# Altium schematic sheet mainsheet.SchDoc
size B
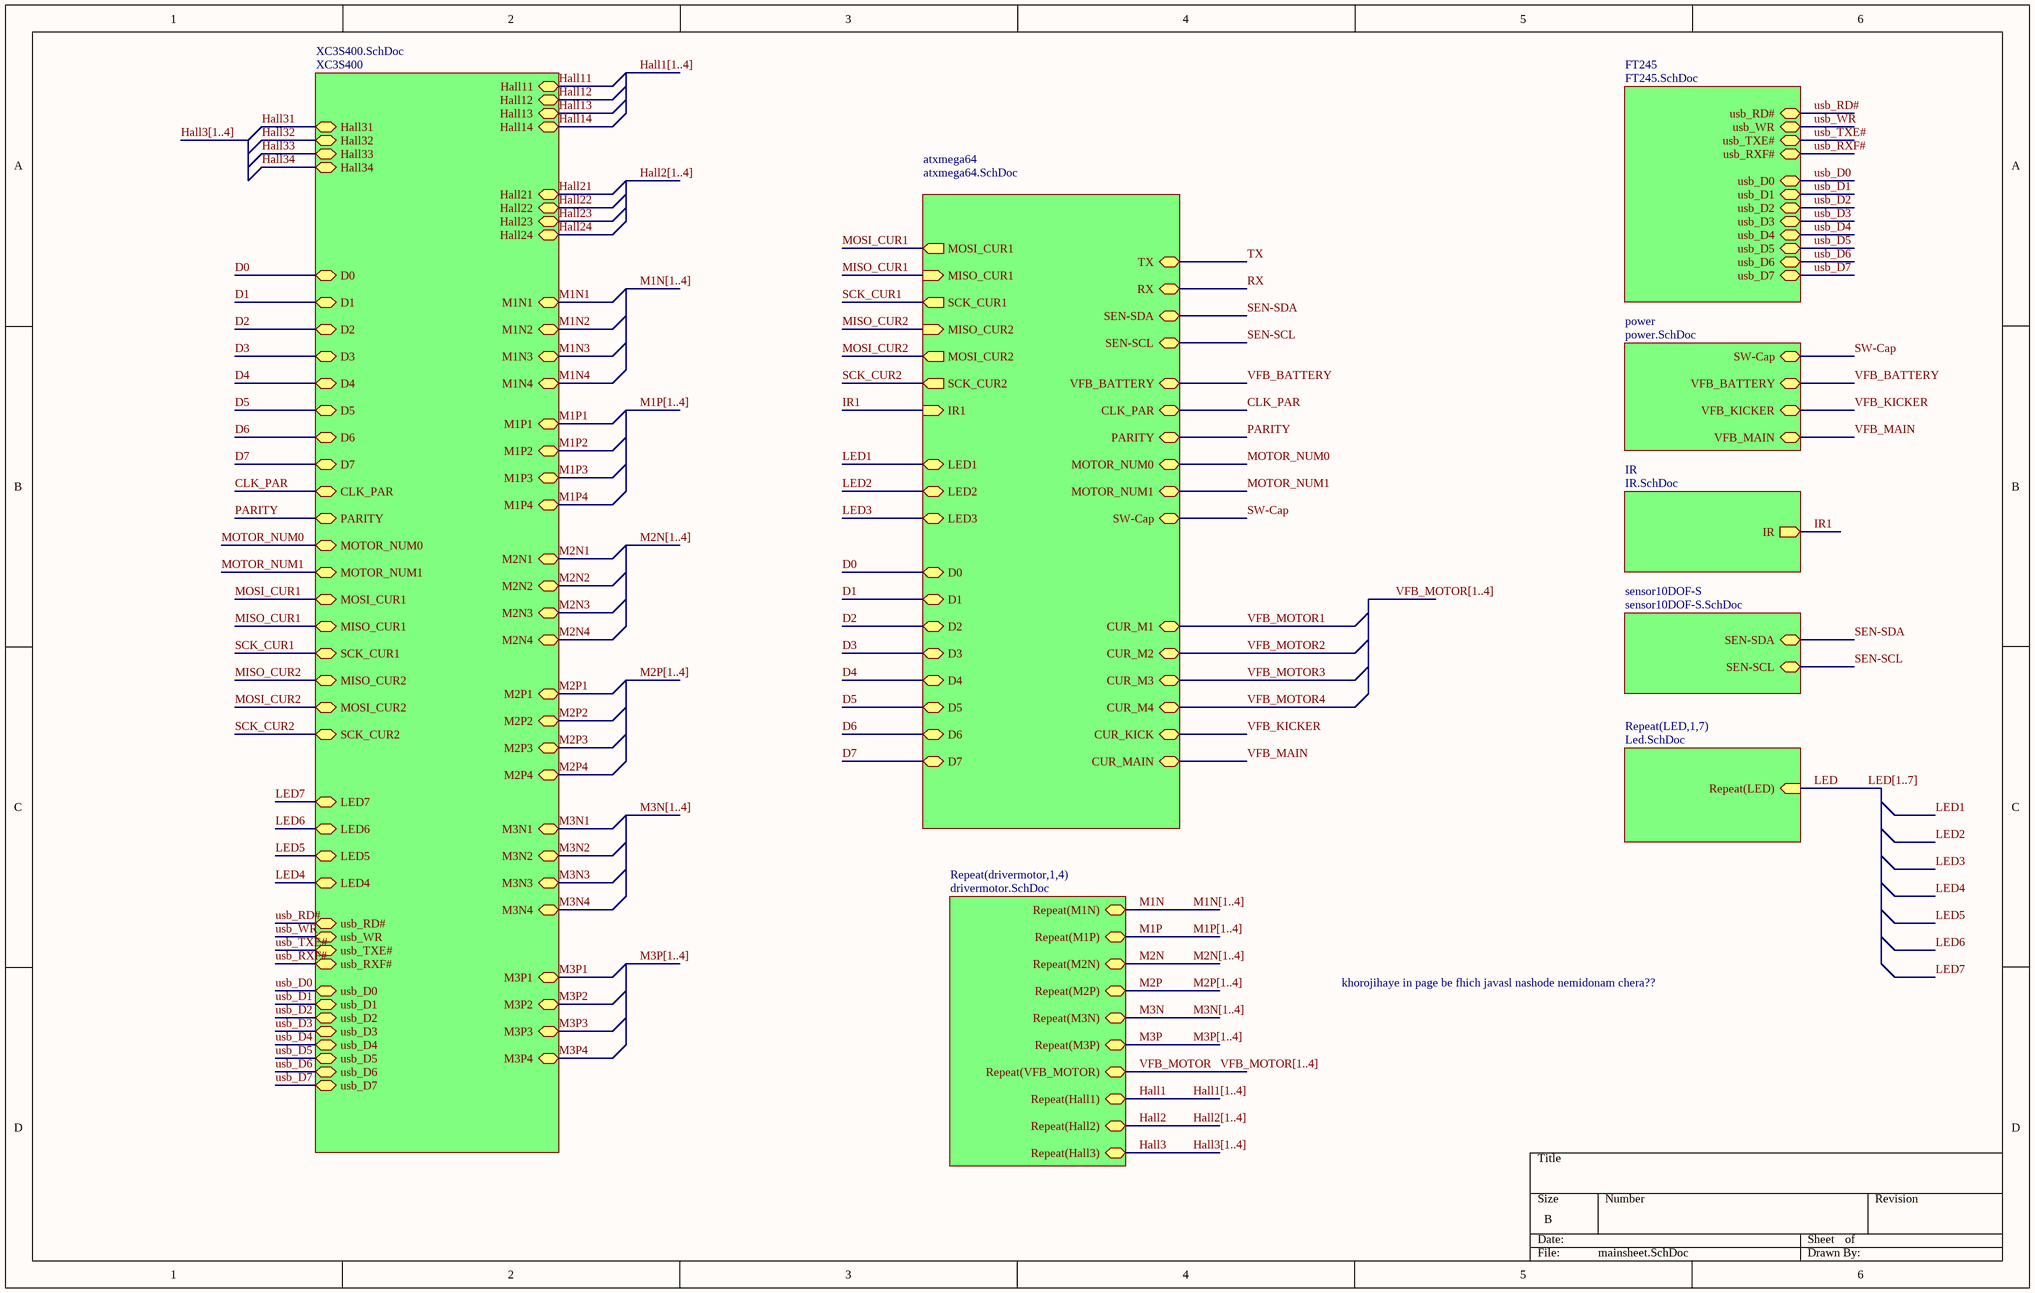
[diagram p0: mainsheet.SchDoc]

## Sub-sheets
atxmega64 = atxmega64.SchDoc: MOSI_CUR1 (out), MISO_CUR1 (in), SCK_CUR1 (out), MISO_CUR2 (in), MOSI_CUR2 (out), SCK_CUR2 (out), IR1 (in), LED1, LED2, LED3, D0, D1, D2, D3, D4, D5, D6, D7, TX, RX, SEN-SDA, SEN-SCL, CLK_PAR, PARITY, MOTOR_NUM0, MOTOR_NUM1, CUR_M1, CUR_M2, CUR_M3, CUR_M4, CUR_KICK, CUR_MAIN, VFB_BATTERY, SW-Cap
FT245 = FT245.SchDoc: usb_RD#, usb_WR, usb_TXE#, usb_RXF#, usb_D0, usb_D1, usb_D2, usb_D3, usb_D4, usb_D5, usb_D6, usb_D7
IR = IR.SchDoc: IR (out)
power = power.SchDoc: SW-Cap, VFB_BATTERY, VFB_KICKER, VFB_MAIN
Repeat(drivermotor,1,4) = drivermotor.SchDoc: Repeat(M1N), Repeat(M1P), Repeat(M2N), Repeat(M2P), Repeat(M3N), Repeat(M3P), Repeat(VFB_MOTOR), Repeat(Hall1), Repeat(Hall2), Repeat(Hall3)
Repeat(LED,1,7) = Led.SchDoc: Repeat(LED) (in)
sensor10DOF-S = sensor10DOF-S.SchDoc: SEN-SDA, SEN-SCL
XC3S400 = XC3S400.SchDoc: D1, D2, D3, D0, D4, D5, D6, D7, MOSI_CUR1, MISO_CUR1, SCK_CUR1, MISO_CUR2, MOSI_CUR2, M1N1, M1N2, M1N3, M1N4, M1P1, M1P2, M1P3, M1P4, M2N1, M2N2, M2N3, M2N4, M2P1, M2P2, M2P3, M2P4, SCK_CUR2, Hall11, Hall12, Hall13, Hall14, Hall33, Hall34, Hall32, Hall31, Hall21, Hall22, Hall23, Hall24, M3N1, M3N2, M3N3, M3N4, M3P1, M3P2, M3P3, M3P4, LED7, LED6, LED5, LED4, CLK_PAR, PARITY, MOTOR_NUM0, MOTOR_NUM1, usb_RD#, usb_WR, usb_TXE#, usb_RXF#, usb_D0, usb_D1, usb_D2, usb_D3, usb_D4, usb_D5, usb_D6, usb_D7

## Nets
CLK_PAR: sheet XC3S400/CLK_PAR, sheet atxmega64/CLK_PAR
D0: sheet XC3S400/D0, sheet atxmega64/D0
D1: sheet XC3S400/D1, sheet atxmega64/D1
D2: sheet XC3S400/D2, sheet atxmega64/D2
D3: sheet XC3S400/D3, sheet atxmega64/D3
D4: sheet XC3S400/D4, sheet atxmega64/D4
D5: sheet XC3S400/D5, sheet atxmega64/D5
D6: sheet XC3S400/D6, sheet atxmega64/D6
D7: sheet XC3S400/D7, sheet atxmega64/D7
Hall1: sheet Repeat(drivermotor,1,4)/Repeat(Hall1)
Hall2: sheet Repeat(drivermotor,1,4)/Repeat(Hall2)
Hall3: sheet Repeat(drivermotor,1,4)/Repeat(Hall3)
Hall11: sheet XC3S400/Hall11
Hall12: sheet XC3S400/Hall12
Hall13: sheet XC3S400/Hall13
Hall14: sheet XC3S400/Hall14
Hall21: sheet XC3S400/Hall21
Hall22: sheet XC3S400/Hall22
Hall23: sheet XC3S400/Hall23
Hall24: sheet XC3S400/Hall24
Hall31: sheet XC3S400/Hall31
Hall32: sheet XC3S400/Hall32
Hall33: sheet XC3S400/Hall33
Hall34: sheet XC3S400/Hall34
IR1: sheet atxmega64/IR1, sheet IR/IR
LED: sheet Repeat(LED,1,7)/Repeat(LED)
LED1: sheet atxmega64/LED1
LED2: sheet atxmega64/LED2
LED3: sheet atxmega64/LED3
LED4: sheet XC3S400/LED4
LED5: sheet XC3S400/LED5
LED6: sheet XC3S400/LED6
LED7: sheet XC3S400/LED7
M1N: sheet Repeat(drivermotor,1,4)/Repeat(M1N)
M1N1: sheet XC3S400/M1N1
M1N2: sheet XC3S400/M1N2
M1N3: sheet XC3S400/M1N3
M1N4: sheet XC3S400/M1N4
M1P: sheet Repeat(drivermotor,1,4)/Repeat(M1P)
M1P1: sheet XC3S400/M1P1
M1P2: sheet XC3S400/M1P2
M1P3: sheet XC3S400/M1P3
M1P4: sheet XC3S400/M1P4
M2N: sheet Repeat(drivermotor,1,4)/Repeat(M2N)
M2N1: sheet XC3S400/M2N1
M2N2: sheet XC3S400/M2N2
M2N3: sheet XC3S400/M2N3
M2N4: sheet XC3S400/M2N4
M2P: sheet Repeat(drivermotor,1,4)/Repeat(M2P)
M2P1: sheet XC3S400/M2P1
M2P2: sheet XC3S400/M2P2
M2P3: sheet XC3S400/M2P3
M2P4: sheet XC3S400/M2P4
M3N: sheet Repeat(drivermotor,1,4)/Repeat(M3N)
M3N1: sheet XC3S400/M3N1
M3N2: sheet XC3S400/M3N2
M3N3: sheet XC3S400/M3N3
M3N4: sheet XC3S400/M3N4
M3P: sheet Repeat(drivermotor,1,4)/Repeat(M3P)
M3P1: sheet XC3S400/M3P1
M3P2: sheet XC3S400/M3P2
M3P3: sheet XC3S400/M3P3
M3P4: sheet XC3S400/M3P4
MISO_CUR1: sheet XC3S400/MISO_CUR1, sheet atxmega64/MISO_CUR1
MISO_CUR2: sheet XC3S400/MISO_CUR2, sheet atxmega64/MISO_CUR2
MOSI_CUR1: sheet XC3S400/MOSI_CUR1, sheet atxmega64/MOSI_CUR1
MOSI_CUR2: sheet XC3S400/MOSI_CUR2, sheet atxmega64/MOSI_CUR2
MOTOR_NUM0: sheet XC3S400/MOTOR_NUM0, sheet atxmega64/MOTOR_NUM0
MOTOR_NUM1: sheet XC3S400/MOTOR_NUM1, sheet atxmega64/MOTOR_NUM1
PARITY: sheet XC3S400/PARITY, sheet atxmega64/PARITY
RX: sheet atxmega64/RX
SCK_CUR1: sheet XC3S400/SCK_CUR1, sheet atxmega64/SCK_CUR1
SCK_CUR2: sheet XC3S400/SCK_CUR2, sheet atxmega64/SCK_CUR2
SEN-SCL: sheet atxmega64/SEN-SCL, sheet sensor10DOF-S/SEN-SCL
SEN-SDA: sheet atxmega64/SEN-SDA, sheet sensor10DOF-S/SEN-SDA
SW-Cap: sheet atxmega64/SW-Cap, sheet power/SW-Cap
TX: sheet atxmega64/TX
usb_D0: sheet XC3S400/usb_D0, sheet FT245/usb_D0
usb_D1: sheet XC3S400/usb_D1, sheet FT245/usb_D1
usb_D2: sheet XC3S400/usb_D2, sheet FT245/usb_D2
usb_D3: sheet XC3S400/usb_D3, sheet FT245/usb_D3
usb_D4: sheet XC3S400/usb_D4, sheet FT245/usb_D4
usb_D5: sheet XC3S400/usb_D5, sheet FT245/usb_D5
usb_D6: sheet XC3S400/usb_D6, sheet FT245/usb_D6
usb_D7: sheet XC3S400/usb_D7, sheet FT245/usb_D7
usb_RD#: sheet XC3S400/usb_RD#, sheet FT245/usb_RD#
usb_RXF#: sheet XC3S400/usb_RXF#, sheet FT245/usb_RXF#
usb_TXE#: sheet XC3S400/usb_TXE#, sheet FT245/usb_TXE#
usb_WR: sheet XC3S400/usb_WR, sheet FT245/usb_WR
VFB_BATTERY: sheet atxmega64/VFB_BATTERY, sheet power/VFB_BATTERY
VFB_KICKER: sheet atxmega64/CUR_KICK, sheet power/VFB_KICKER
VFB_MAIN: sheet atxmega64/CUR_MAIN, sheet power/VFB_MAIN
VFB_MOTOR: sheet Repeat(drivermotor,1,4)/Repeat(VFB_MOTOR)
VFB_MOTOR1: sheet atxmega64/CUR_M1
VFB_MOTOR2: sheet atxmega64/CUR_M2
VFB_MOTOR3: sheet atxmega64/CUR_M3
VFB_MOTOR4: sheet atxmega64/CUR_M4

## Buses and harness runs
bus Hall1[1..4]
bus Hall2[1..4]
bus Hall3[1..4]
bus LED[1..7]
bus M1N[1..4]
bus M1P[1..4]
bus M2N[1..4]
bus M2P[1..4]
bus M3N[1..4]
bus M3P[1..4]
bus VFB_MOTOR[1..4]

## Notes on the sheet
- khorojihaye in page be fhich javasl nashode nemidonam chera??